# EAGLE design gnode (EAGLE 6.6.0)
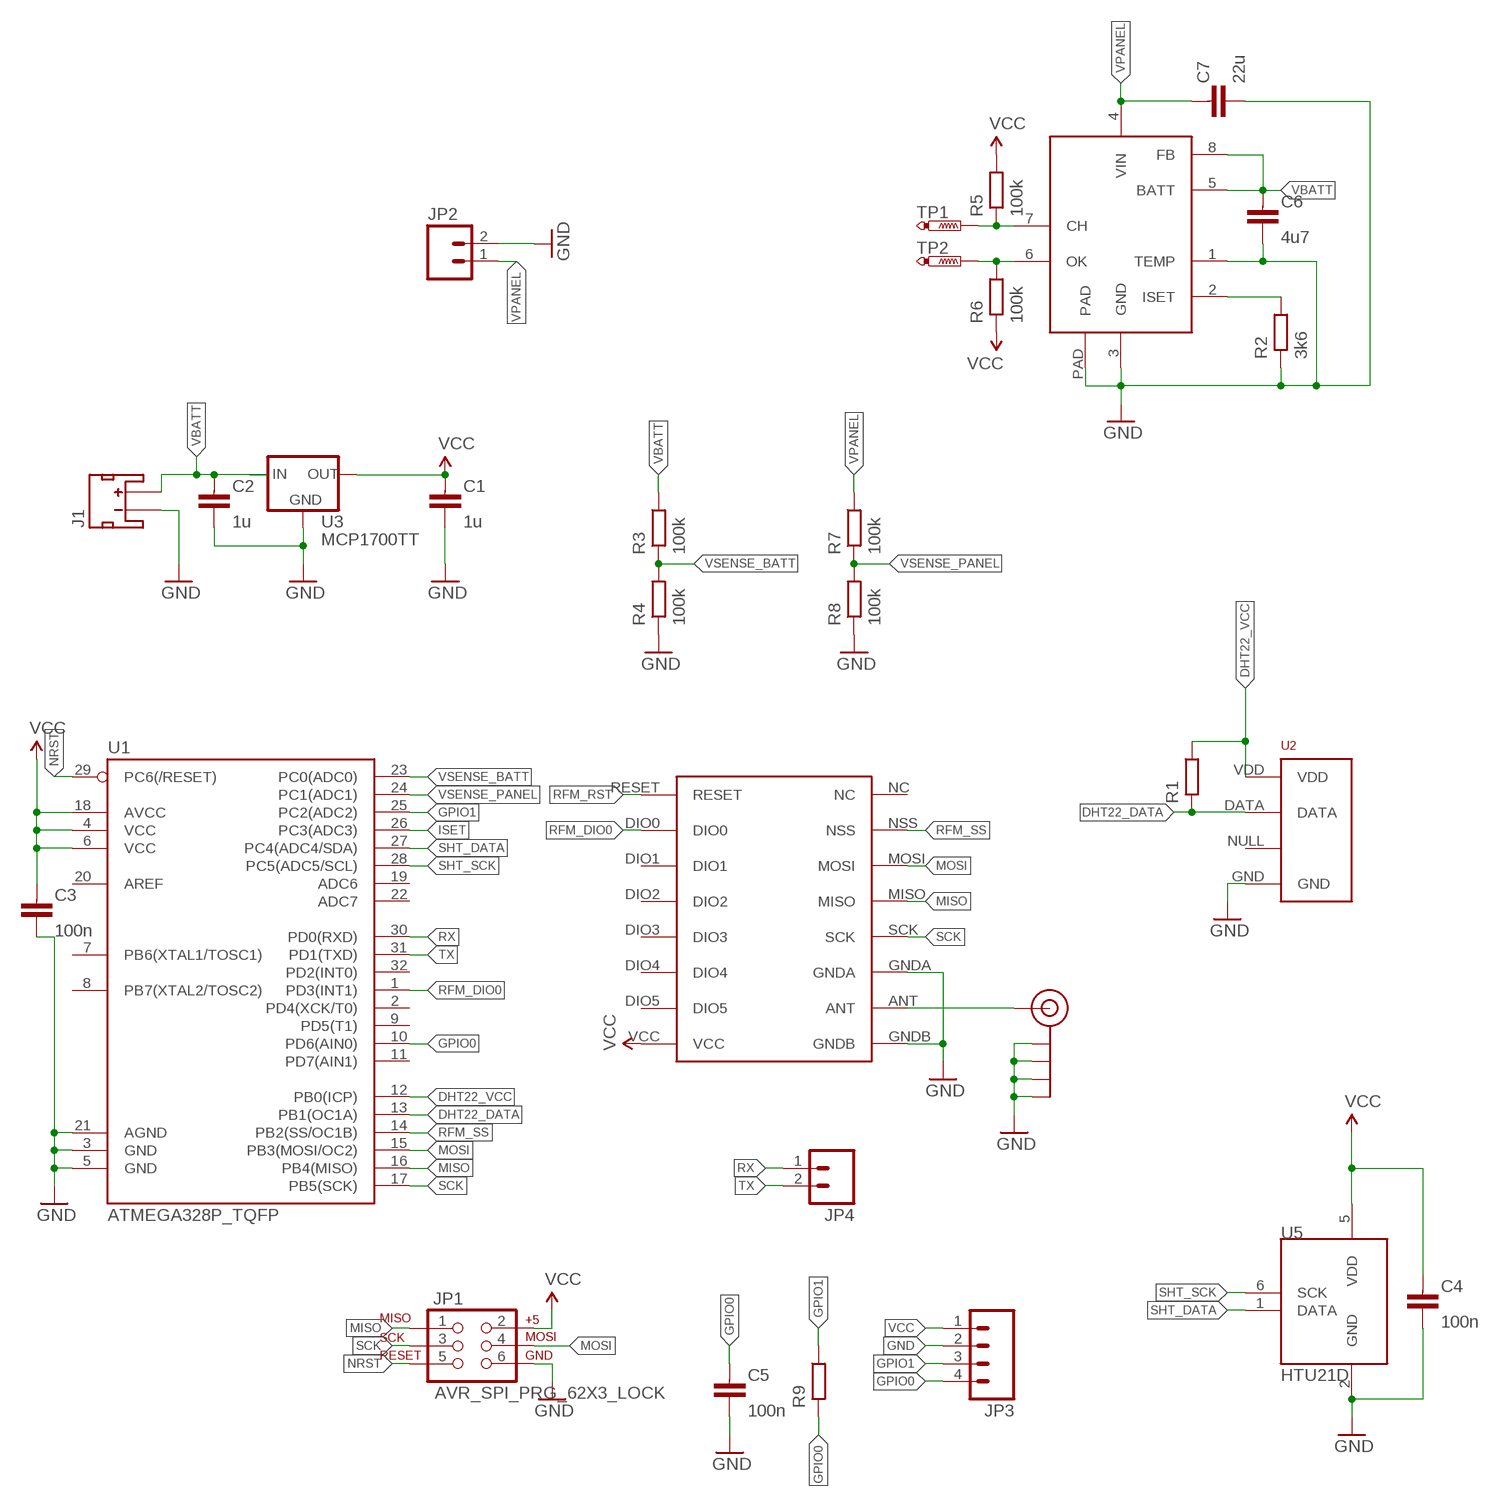
[diagram p0: schematic, sheet 1]

## Parts
C1  1u  CAPACITOR0603-N  [C0603-N]
C2  1u  CAPACITOR0603-N  [C0603-N]
C3  100n  CAPACITOR0603-N  [C0603-N]
C4  100n  CAPACITOR0603-N  [C0603-N]
C5  100n  CAPACITOR0603-N  [C0603-N]
C6  4u7  CAPACITOR0603-N  [C0603-N]
C7  22u  CAPACITOR0603-N  [C0603-N]
J1  JST_2MM_MALE_TH  [JST-2-TH]
J$1  SMA_EDGE  [SMA-EDGE]
JP1  AVR_SPI_PRG_62X3_LOCK  [2X3_LOCK]
JP2  M02PTH  [1X02]
JP3  M04PTH  [1X04]
JP4  M02PTH  [1X02]
R1  RESISTOR0603-N  [R0603-N]
R2  3k6  RESISTOR0603-N  [R0603-N]
R3  100k  RESISTOR0603-N  [R0603-N]
R4  100k  RESISTOR0603-N  [R0603-N]
R5  100k  RESISTOR0603-N  [R0603-N]
R6  100k  RESISTOR0603-N  [R0603-N]
R7  100k  RESISTOR0603-N  [R0603-N]
R8  100k  RESISTOR0603-N  [R0603-N]
R9  RESISTOR0603-N  [R0603-N]
TP1  PTR1B1,27  [B1,27]
TP2  PTR1B1,27  [B1,27]
U1  ATMEGA328P_TQFP  [TQFP32-08]
U2  RHT03_DHT-22_AM2302  [RHT03_DHT-22]
U3  MCP1700TT  [SOT23]
U4  CN3083  [SO8-PAD]
U5  HTU21D  [DFN6-L]
U$1  RFM69HW  [RFM]

## Nets
DHT22_DATA: R1.1 U1.13(PB1(OC1A)) U2.DATA
DHT22_VCC: R1.2 U1.12(PB0(ICP)) U2.VDD
GND: C1.2 C2.2 C3.2 C4.2 C5.2 C6.2 C7.2 J1.2(-) J$1.GND@0(GND) J$1.GND@1(GND) J$1.GND@2(GND) J$1.GND@3(GND) JP1.6 JP2.2 JP3.2 R2.1 R4.1 R8.1 U1.3(GND) U1.5(GND) U1.21(AGND) U2.GND U3.1(GND) U4.1(TEMP) U4.3(GND) U4.PAD U5.2(GND) U$1.GNDA U$1.GNDB
GPIO0: C5.1 JP3.4 R9.1 U1.10(PD6(AIN0))
GPIO1: JP3.3 R9.2 U1.25(PC2(ADC2))
ISET: R2.2 U1.26(PC3(ADC3)) U4.2(ISET)
MISO: JP1.1 U1.16(PB4(MISO)) U$1.MISO
MOSI: JP1.4 U1.15(PB3(MOSI/OC2)) U$1.MOSI
N$1: J$1.SIG(SIGNAL) U$1.ANT
N$2: R5.1 TP1.TP U4.7(CH)
N$5: R6.2 TP2.TP U4.6(OK)
NRST: JP1.5 U1.29(PC6(/RESET))
RFM_DIO0: U1.1(PD3(INT1)) U$1.DIO0
RFM_RST: U$1.RESET
RFM_SS: U1.14(PB2(SS/OC1B)) U$1.NSS
RX: JP4.1 U1.30(PD0(RXD))
SCK: JP1.3 U1.17(PB5(SCK)) U$1.SCK
SHT_DATA: U1.27(PC4(ADC4/SDA)) U5.1(DATA)
SHT_SCK: U1.28(PC5(ADC5/SCL)) U5.6(SCK)
TX: JP4.2 U1.31(PD1(TXD))
VBATT: C2.1 C6.1 J1.1(+) R3.2 U3.3(IN) U4.5(BATT) U4.8(FB)
VCC: C1.1 C3.1 C4.1 JP1.2 JP3.1 R5.2 R6.1 U1.4(VCC) U1.6(VCC) U1.18(AVCC) U3.2(OUT) U5.5(VDD) U$1.VCC
VPANEL: C7.1 JP2.1 R7.2 U4.4(VIN)
VSENSE_BATT: R3.1 R4.2 U1.23(PC0(ADC0))
VSENSE_PANEL: R7.1 R8.2 U1.24(PC1(ADC1))
Unconnected: U1.2(PD4(XCK/T0)) U1.7(PB6(XTAL1/TOSC1)) U1.8(PB7(XTAL2/TOSC2)) U1.9(PD5(T1)) U1.11(PD7(AIN1)) U1.19(ADC6) U1.20(AREF) U1.22(ADC7) U1.32(PD2(INT0)) U2.NULL U$1.DIO1 U$1.DIO2 U$1.DIO3 U$1.DIO4 U$1.DIO5 U$1.NC

## Library data of the parts
C1-C7 = passives-7351:CAPACITOR
J1 = dtb:JST_2MM_MALE_TH: Mates to single-cell LiPo batteries. CONN-08352
J$1 = jonsowman:SMA_EDGE: SMA Antenna Connector End launch SMA connector. The paste layer has been removed so that the connector can be hand soldered onto the board after reflow.
JP1 = SparkFun-Connectors:AVR_SPI_PRG_6: AVR ISP 6 Pin This is the reduced ISP connector for AVR programming. Common on Arduino. This footprint will take up less PCB space and can be used with a 10-pin to 6-pin adapter such as SKU: BOB-08508 **Special note about "TEST_POINT" package. The stop mask is on the top side, so if you want your programming test points to be on the bottom of your board, make sure to place this package on the bottom side of the board. This also ensure that the orientation to program from the bottom side will be correct.
JP2 JP4 = Mine:M02: Header 2 Standard 2-pin 0.1" header. Use with straight break away headers (SKU : PRT-00116), right angle break away headers (PRT-00553), swiss pins (PRT-00743), machine pins (PRT-00117), and female headers (PRT-00115). Molex polarized connector foot print use with SKU : PRT-08233 with associated crimp pins and housings.
JP3 = SparkFun-Connectors:M04: Header 4 Standard 4-pin 0.1" header. Use with straight break away headers (SKU : PRT-00116), right angle break away headers (PRT-00553), swiss pins (PRT-00743), machine pins (PRT-00117), and female headers (PRT-00115). Molex polarized connector foot print use with SKU : PRT-08231 with associated crimp pins and housings. 1MM SMD Version SKU: PRT-10208
R1-R9 = passives-7351:RESISTOR
TP1 TP2 = testpad:PTR1: TEST PIN
U1 = SparkFun-DigitalIC:ATMEGA328P_TQFP; PROD_ID: IC-09069
U2 = RHT03_DHT-22_AM2302:RHT03_DHT-22_AM2302: RHT03 / DHT-22 / AM2302 Packages and symbol for the RHT03 / DHT-22 relative humidity and temperature sensor. Note: The AM2302 is a wired version of the DHT-22 which typically requires less clearance and is thus provided as a separate package.; PROD_ID: SEN-10167
U3 = dtb:MCP1700
U4 = jonsowman:CN3083
U5 = Mine:HTU21D
U$1 = hoperf:RFM69HW

## Board
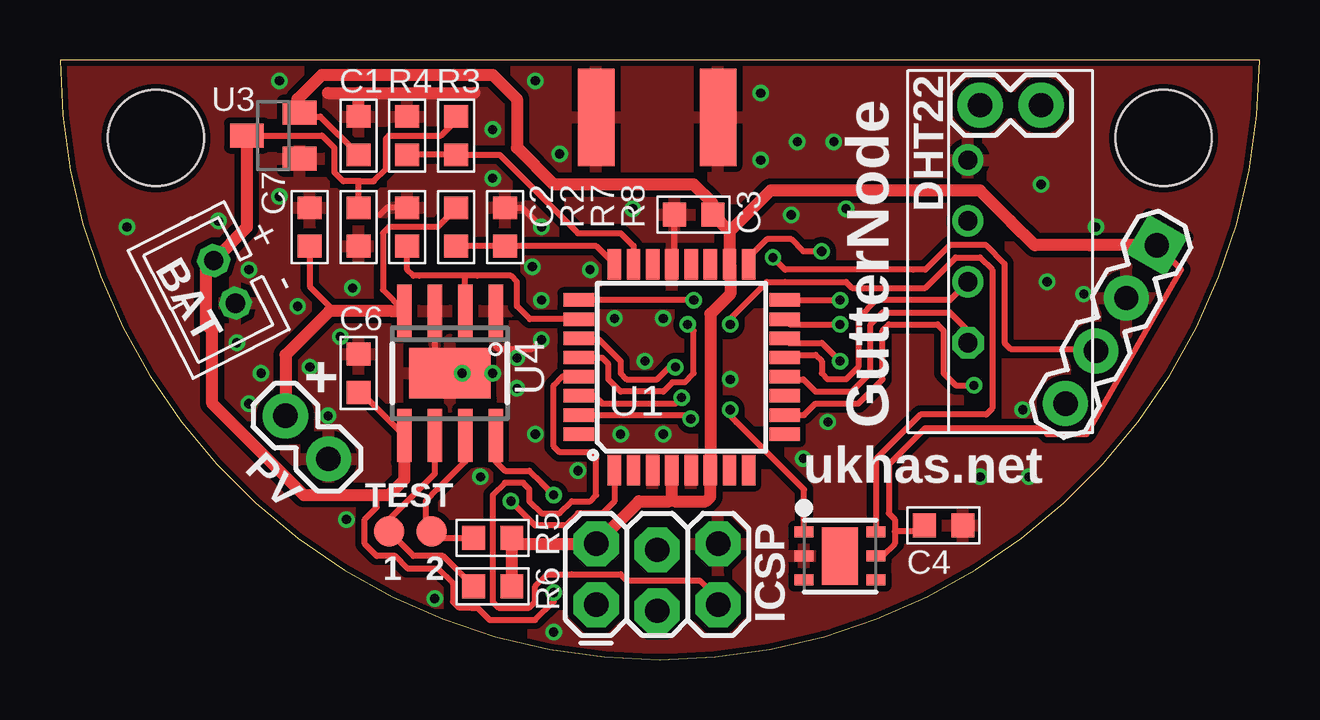
[diagram p1: board, top side]
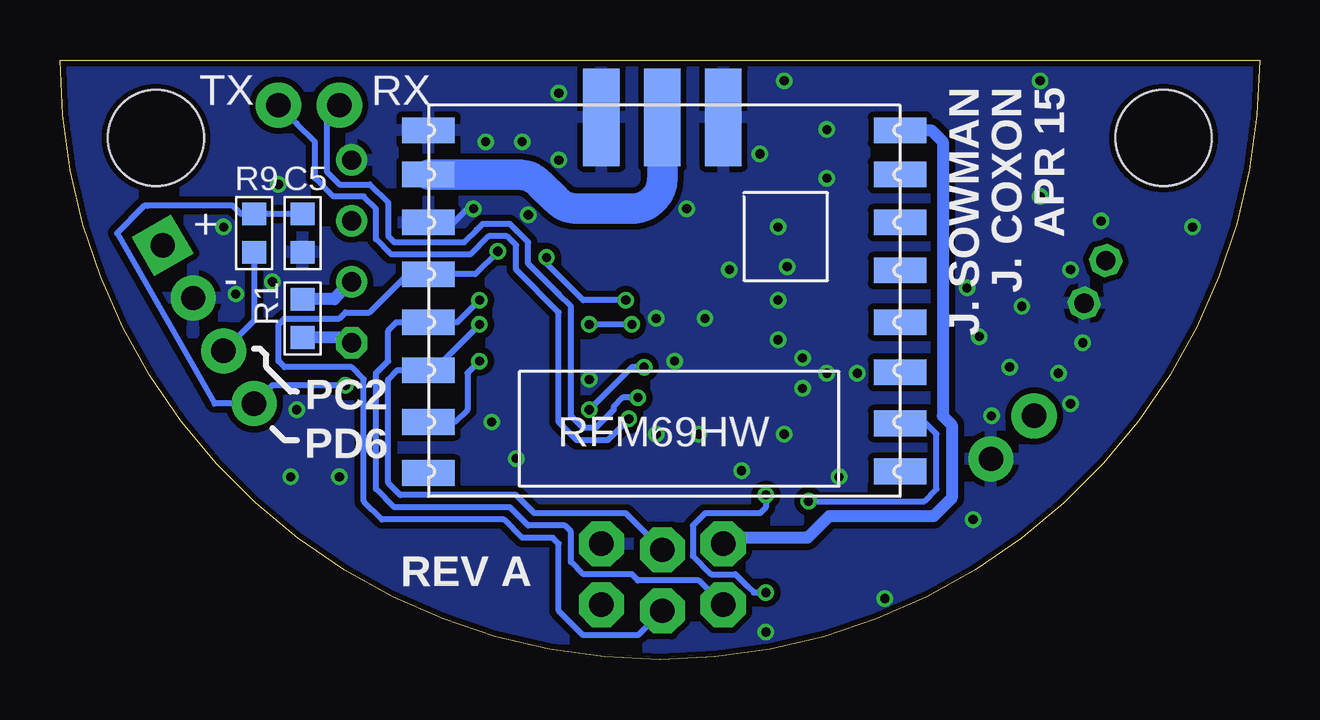
[diagram p2: board, bottom side, seen from below]

Size 50 x 25 mm. Coordinates in mm from the lower left corner, seen from the top.
Outline: 0,25 arc90 25,0 arc90 50,25 0,25
Copper layers (1*16): Top 0.035mm / dielectric 1.5mm / Bottom 0.035mm
Design rules "SeeedStudio_2layer_DRU_no_angle_20140221 *": minimum track width 6mil, minimum drill 12mil, track to track 6mil, track to pad 6mil, pad to pad 6mil, via to via 6mil, smd to smd 0mil, copper to edge 10mil, drill to drill 10mil, minimum pad ring 10mil, minimum via ring 6mil, stop-mask expansion 2mil, vias tented up to drill 100mil, thermal gap 10mil
Holes 4 mm at 4,21.75 46,21.75

### Footprints (pad centres in the part's own frame; a part is rotated, then mirrored left to right if it is on the bottom)
C0603-N = smd 0.95 x 1: 1 -0.8,0; 2 0.8,0
JST-2-TH = drill 0.8 octagon: 1 1,0; 2 -1,0
SMA-EDGE = smd 1.524 x 4.064: GND@0 0,0; GND@1 5.08,0; SIG 2.54,0 | smd 1.524 x 4.064 bottom: GND@2 0,0; GND@3 5.08,0
2X3_LOCK = drill 1.016 pad 1.88 octagon: 1 0,0; 2 0,2.54; 3 2.54,-0.254; 4 2.54,2.286; 5 5.08,0; 6 5.08,2.54
1X02 = drill 1.016 pad 1.88: 1 0,0; 2 2.54,0
1X04 = drill 1.016 pad 1.88 square: 1 0,0 | drill 1.016 pad 1.88: 2 2.54,0; 3 5.08,0; 4 7.62,0
R0603-N = smd 0.95 x 1: 1 -0.8,0; 2 0.8,0
B1,27 = smd 1.27 x 1.27: TP 0,0
TQFP32-08 = smd 1.27 x 0.559: 1 -4.293,2.8; 2 -4.293,2; 3 -4.293,1.2; 4 -4.293,0.4; 5 -4.293,-0.4; 6 -4.293,-1.2; 7 -4.293,-2; 8 -4.293,-2.8; 17 4.293,-2.8; 18 4.293,-2; 19 4.293,-1.2; 20 4.293,-0.4; 21 4.293,0.4; 22 4.293,1.2; 23 4.293,2; 24 4.293,2.8 | smd 0.559 x 1.27: 9 -2.8,-4.293; 10 -2,-4.293; 11 -1.2,-4.293; 12 -0.4,-4.293; 13 0.4,-4.293; 14 1.2,-4.293; 15 2,-4.293; 16 2.8,-4.293; 25 2.8,4.293; 26 2,4.293; 27 1.2,4.293; 28 0.4,4.293; 29 -0.4,4.293; 30 -1.2,4.293; 31 -2,4.293; 32 -2.8,4.293
RHT03_DHT-22 = drill 0.8: DATA -1.27,0; GND 3.81,0; NULL 1.27,0 | drill 0.8 octagon: VDD -3.81,0
SOT23 = smd 1 x 1.4: 1 -0.95,-1.1; 2 0.95,-1.1; 3 0,1.1
SO8-PAD = smd 0.6 x 2.2: 1 -1.905,-2.6; 2 -0.635,-2.6; 3 0.635,-2.6; 4 1.905,-2.6; 5 1.905,2.6; 6 0.635,2.6; 7 -0.635,2.6; 8 -1.905,2.6 | smd 3.4 x 2.1: PAD 0,0
DFN6-L = smd 0.45 x 0.8: 1 -1,-1.5; 2 0,-1.5; 3 1,-1.5; 4 1,1.5; 5 0,1.5; 6 -1,1.5 | smd 2.4 x 1.5: EP 0,0
RFM = smd 2.184 x 1.067: ANT 19.651,2.889; DIO0 0,13.27; DIO1 0,11.143; DIO2 0,9.047; DIO3 0,6.889; DIO4 0,4.889; DIO5 0,2.889; GNDA 19.651,4.889; GNDB 19.651,1.048; MISO 19.651,9.047; MOSI 19.651,11.047; NC 19.651,15.334; NSS 19.651,13.206; RESET 0,15.27; SCK 19.651,7.048; VCC 0,1.048

### Placement (x,y rotation side)
C1  12.45,21.84 90 top
C2  12.45,18.03 270 top
C3  26.42,18.54 180 top
C4  36.83,5.59 0 top
C5  39.88,17.78 270 bottom
C6  12.45,11.94 90 top
C7  10.41,18.03 90 top
J1  6.86,15.75 117 top
J$1  27.43,22.61 0 bottom
JP1  22.35,2.29 0 top
JP2  9.4,10.16 315 top
JP3  45.72,17.27 240 top
JP4  38.35,23.11 0 top
R1  39.88,14.22 270 bottom
R2  14.48,18.03 270 top
R3  16.51,21.84 90 top
R4  14.48,21.84 270 top
R5  18.03,5.08 0 top
R6  18.03,3.05 180 top
R7  16.51,18.03 90 top
R8  18.54,18.03 270 top
R9  41.91,17.78 270 bottom
TP1  15.49,5.33 0 top
TP2  13.72,5.33 0 top
U1  25.91,12.19 90 top
U2  37.85,17.02 90 top
U3  8.89,21.84 90 top
U4  16.26,11.94 180 top
U5  32.51,4.32 270 top
U$1  14.99,23.11 180 bottom

### Tracks (layer width: path | path; a pad name or v marks a point on that pad's centre or on a via)
DHT22_DATA
  Top 0.254: U1.13 30.31,12.7 31.5,12.7 31.75,12.45 31.75,11.94 32,11.68 32.77,11.68 33.27,12.19 33.27,14.22 34.04,14.99 37.08,14.99 U2.DATA
  Bottom 0.508: U2.DATA 38.57,15.02 R1.1
DHT22_VCC
  Top 0.254: U1.12 30.31,11.68 30.99,11.68 31.5,11.18 33.02,11.18 33.78,11.94 33.78,13.97 34.29,14.48 37.08,14.48 37.85,13.72 U2.VDD
  Bottom 0.508: U2.VDD 38.06,13.42 R1.2
GND  (via drill 0.38)
  Top 0.254: U1.21 25.62,16.59 C3.2 | R2.1 13.63,18.83 13.34,18.54 | U4.3 15.62,12.83 15.75,12.7 15.75,12.45 U4.PAD | v20.07,13.34 19.68,12.95 18.29,12.95 18.23,13.01 18.16,13.08 U4.1 | R8.1 19.27,18.83 v20.07,18.03
  Top 0.508: 11.18,23.62 12.45,23.62 | 12.45,23.62 17.27,23.62 | C1.2 12.45,23.62
  Bottom 0.254: U$1.GNDA 33.59,18.23 33.02,18.8
  other vias: 29.21,23.62 29.21,20.83 19.81,24.13 20.83,21.08 18.03,22.1 23.88,18.8 30.73,21.59 32.26,21.59 32.77,18.8 23.37,9.4 25.15,9.4 2.79,18.03 6.6,18.29 7.87,10.67 8.38,11.94 9.14,19.3 7.87,16.26 19.81,9.4 11.18,10.16 11.94,5.84 22.1,16.26 21.59,7.87 32,9.91 30.99,8.38 27.94,11.68 25.15,14.22 42.67,15.24 40.13,10.41 38.35,7.62 40.39,7.62 40.89,19.81 43.18,18.03 20.07,14.99 19.68,16.38 12.19,15.49 7.37,13.21 9.14,24.13 17.53,7.62 41.15,15.75 30.48,18.54 24.38,12.45 23.11,14.22 16.76,11.94 18.03,11.94 19.05,12.57 19.05,11.3 11.68,13.46 10.41,12.19 9.91,14.73 18.03,20.07 15.62,2.54 20.57,1.14
  pour Top (isolate 0.254): 0,24.89 50.04,24.89 50.04,0 0,0
  pour Bottom (isolate 0.254): -0.25,25.15 50.04,25.15 50.04,0 -0.25,0
GPIO0  (via drill 0.38)
  Top 0.254: U1.10 31.02,10.19 31.5,10.67 33.27,10.67 34.29,11.68 34.29,13.72 34.54,13.97 36.58,13.97 36.83,13.72 36.83,11.94 37.34,11.43 v38.1,11.43
  Bottom 0.254: v38.1,11.43 41.15,11.43 JP3.4 43.56,10.67 47.62,17.78 46.48,18.92 46.35,18.92 42.8,18.92 42.46,18.58 C5.1 R9.1
GPIO1  (via drill 0.38)
  Top 0.254: v29.72,16.76 30.23,16.26 35.56,16.26 36.07,16.26 37.08,17.27 38.61,17.27 39.37,16.51 39.37,13.21 39.62,12.95 43.1,12.95 JP3.3 | v26.42,14.99 U1.25
  Bottom 0.254: R9.2 41.91,14.14 JP3.3 | v26.42,14.99 28.19,14.99 29.46,16.26 29.72,16.51 v29.72,16.76
ISET
  Top 0.254: 16.89,16 17.4,16 18.8,16 19.05,15.75 19.05,14.73 19.59,14.19 U1.26 | 16.89,16 14.99,16 14.73,16 14.48,16.26 R2.2 | U4.2 16.89,16
MISO  (via drill 0.38)
  Top 0.254: U1.16 v32.51,14.99
  Bottom 0.254: JP1.1 23.37,3.3 25.91,3.3 26.16,3.56 28.19,3.56 28.7,4.06 28.7,5.33 28.96,5.59 30.48,5.59 31.24,6.35 36.07,6.35 36.83,7.11 36.83,11.94 36.32,12.45 36.32,13.72 35.97,14.07 U$1.MISO 33.69,14.07 33.43,14.07 v32.51,14.99
MOSI  (via drill 0.38)
  Top 0.254: U1.15 30.42,13.97 v32.51,13.97
  Bottom 0.254: v32.51,13.97 34.42,12.07 U$1.MOSI 35.94,12.07 36.32,11.68 36.32,7.37 35.81,6.86 30.99,6.86 30.23,6.1 26.42,6.1 JP1.4
N$1
  Bottom 1.27: J$1.SIG 24.89,20.07 arc90 26.16,18.8 28.43,18.8 arc45 29.33,19.17 30.01,19.85 arc-45 30.91,20.23 U$1.ANT
N$2
  Top 0.254: 17.14,5.17 R5.1 16.51,5.08 15.75,5.08 TP1.TP 15.24,5.59 15.24,6.6 15.75,7.11 16.89,8.26 U4.7
N$5
  Top 0.254: R6.2 15.96,4.32 14.73,4.32 TP2.TP 13.72,5.84 15.49,7.62 15.62,7.75 U4.6
NRST
  Top 0.254: JP1.5 27.43,2.54 26.67,3.3 23.62,3.3 23.37,3.56 21.34,3.56 20.32,3.56 19.81,3.05 19.81,2.41 19.56,2.16 19.18,2.16 18.29,2.16 18.03,2.41 18.03,6.86 18.54,7.37 19.3,7.37 19.56,7.11 19.56,6.6 20.07,6.1 20.83,6.1 21.34,6.6 22.1,6.6 22.35,6.86 22.35,8.38 22.1,8.64 20.83,8.64 20.57,8.89 20.57,11.43 20.94,11.79 U1.29 21.51,11.68
RFM_DIO0  (via drill 0.38)
  Top 0.254: U1.1 23.11,6.6 22.61,6.1 21.59,6.1 21.08,5.59 19.81,5.59 v18.8,6.6
  Bottom 0.254: v18.8,6.6 13.97,6.6 13.46,7.11 13.46,9.4 13.91,9.84 U$1.DIO0
RFM_SS  (via drill 0.38)
  Top 0.254: U1.14 30.39,13.21 31.75,13.21 v32.51,12.45
  Bottom 0.254: v32.51,12.45 33.02,11.94 33.02,10.41 33.53,9.91 U$1.NSS
RX  (via drill 0.38)
  Top 0.254: U1.30 22.28,10.99 22.61,10.67 25.65,10.67 v25.91,10.92
  Bottom 0.254: v25.91,10.92 26.54,10.92 26.92,10.54 26.92,10.41 27.69,9.65 28.19,9.65 28.7,10.16 28.7,14.73 29.21,15.24 30.48,16.51 30.48,17.4 31.24,18.16 32.38,18.16 32.64,17.91 33.15,17.4 36.07,17.4 36.32,17.65 36.32,19.05 37.08,19.81 38.35,19.81 38.86,20.32 38.86,22.61 JP4.1
SCK  (via drill 0.38)
  Top 0.254: v31.75,17.02 30.99,17.02 30.48,17.53 29.46,17.53 29.34,17.4 | 29.34,17.4 29.21,17.27 | U1.17 28.71,16.77 29.34,17.4
  Bottom 0.254: v31.75,17.02 32.7,16.07 U$1.SCK 35.49,16.07 37.08,14.48 38.1,14.48 38.35,14.22 40.64,14.22 40.89,13.97 40.89,12.45 40.64,12.19 37.85,12.19 37.34,11.68 37.34,6.6 36.58,5.84 31.5,5.84 30.73,5.08 29.46,5.08 29.21,4.83 29.21,2.03 28.19,1.02 25.91,1.02 JP1.3
SHT_DATA  (via drill 0.38)
  Top 0.254: U5.1 31.01,7.09 28.19,9.91 27.94,10.16 v27.94,10.41 | U1.27 21.67,13.34 22.48,13.34 23.37,12.45 23.37,11.94 23.62,11.68 24.89,11.68 25.4,12.19 v25.65,12.19
  Bottom 0.254: v25.65,12.19 26.16,12.19 v27.94,10.41
SHT_SCK  (via drill 0.38)
  Top 0.254: v26.16,13.97 26.42,13.72 26.42,11.94 26.04,11.56 25.53,11.56 25.15,11.18 23.37,11.18 22.86,11.68 22.86,12.32 22.61,12.57 22.59,12.59 U1.28 | v27.94,13.97 27.94,14.22 29.46,15.75 30.23,15.75 32.77,15.75 33.02,15.49 36.07,15.49 37.34,16.76 38.35,16.76 38.86,16.26 38.86,10.47 38.61,10.21 35.87,10.21 34.01,8.36 U5.6
  Bottom 0.254: v26.16,13.97 v27.94,13.97
TX  (via drill 0.38)
  Top 0.254: U1.31 26.13,10.19 v26.29,10.03
  Bottom 0.254: v26.29,10.03 27.18,9.14 28.45,9.14 29.21,9.91 29.21,14.48 30.99,16.26 30.99,17.27 31.37,17.65 32.13,17.65 32.89,16.89 36.07,16.89 36.2,16.89 36.83,17.53 36.83,18.8 37.34,19.3 38.61,19.3 39.37,20.07 39.37,21.59 40.13,22.35 JP4.2
VBATT  (via drill 0.38)
  Top 0.254: R3.2 16.51,22.48 15.88,21.84 13.72,21.84 13.59,21.72 13.59,20.45 13.08,19.94 12.54,19.94 12.45,19.94 | U3.3 10.92,21.84 11.43,21.34 11.43,20.94 11.43,20.32 11.81,19.94 12.45,19.94 | v20.57,2.79 20.57,2.41 19.81,1.65 17.91,1.65 17.4,2.16 17.14,2.16 16.64,2.16 16.38,2.41 16.38,3.17 15.75,3.81 14.48,3.81 13.97,4.32 13.21,4.32 12.7,4.83 12.7,5.84 13.21,6.35 13.21,6.86 | U4.8 18.16,8.26 18.54,7.87 19.56,7.87 20.07,7.37 20.32,7.11 v20.57,6.86 | C2.1 12.45,19.94 | C6.1 12.55,11.14 U4.5
  Top 0.508: U3.3 7.79,18.02 J1.1 6.1,16.33 6.1,13.97 6.35,13.72 6.35,10.67 10.16,6.86 11.68,6.86 13.21,6.86 13.72,6.86 14.22,7.37 14.35,7.49 U4.5
  Bottom 0.254: v20.57,6.86 20.57,6.35 20.83,6.1 23.11,6.1 23.62,5.59 23.62,4.32 22.86,3.56 21.84,3.56 21.34,3.05 21.08,2.79 v20.57,2.79
VCC
  Top 0.254: 10.14,22.64 10.85,22.64 C1.1 | 34.8,5.33 34.8,5.84 34.54,6.1 34.54,8.13 36.07,9.65 39.12,9.65 40.89,9.65 41.15,9.4 42.67,9.4 42.8,9.4 46.74,16.26 JP3.1 | 34.8,5.33 34.8,4.83 34.29,4.32 U5.5 | C4.1 35.78,5.33 34.8,5.33
  Top 0.508: 10.14,22.64 U3.2 9.92,22.86 9.91,22.86 9.91,23.37 10.92,24.38 18.03,24.38 19.05,23.37 19.05,21.34 20.57,19.81 26.42,19.81 27.18,19.05 27.18,18.58 C3.1 27.91,17.85 | R6.1 R5.2 19.09,4.83 JP1.2 24.13,6.6 25.4,6.6 25.51,6.71 | 25.51,6.71 U1.4 | 27.91,17.85 U1.18 27.94,16.45 27.94,15.24 27.11,14.41 U1.6 27.11,6.79 26.92,6.6 25.62,6.6 25.51,6.71 | 27.91,17.85 29.62,19.56 38.35,19.56 39.62,18.29 40.64,17.27 42.93,17.27 JP3.1
  Bottom 0.508: U$1.VCC 13.68,22.07 13.21,21.59 13.21,10.16 12.83,9.78 12.83,6.73 13.59,5.97 17.95,5.97 R5.2 22.1,5.08 JP1.2
VPANEL
  Top 0.254: R7.2 16.55,18.83 15.75,18.03 14.48,18.03 13.72,18.03 13.46,17.78 13.46,15.43 U4.4 14.16,14.54 | C7.1 10.41,15.55 11.43,14.54
  Top 0.508: U4.4 14.16,14.54 13.78,14.54 11.43,14.54 11.24,14.54 9.4,12.7 JP2.1
VSENSE_BATT
  Top 0.254: U1.23 23.91,17.24 23.37,17.78 21.59,17.78 18.33,21.04 R3.1 R4.2
VSENSE_PANEL
  Top 0.254: U1.24 22.36,17.23 R8.2 R7.1

### Text on the board
tPlace: DHT22 | BAT | + | GutterNode | PV | ukhas.net | TEST | 1 | 2 | ICSP
bPlace: APR 15 | J. COXON | J. SOWMAN | RX | TX | + | - | PC2 | PD6 | REV A